# Altium schematic sheet MCU.SchDoc: ESP32-S3
size 292 x 193 mm; CheckedBy: Jakub Howors; Author: Łukasz Gójski; CompanyName: Politechnika Warszawska; Organization: EITI; Address1: Nowowiejska 15/19; Address2: 00-665 Warszawa; SheetNumber: 8; SheetTotal: 13; HTTPLink: www.pw.edu.pl
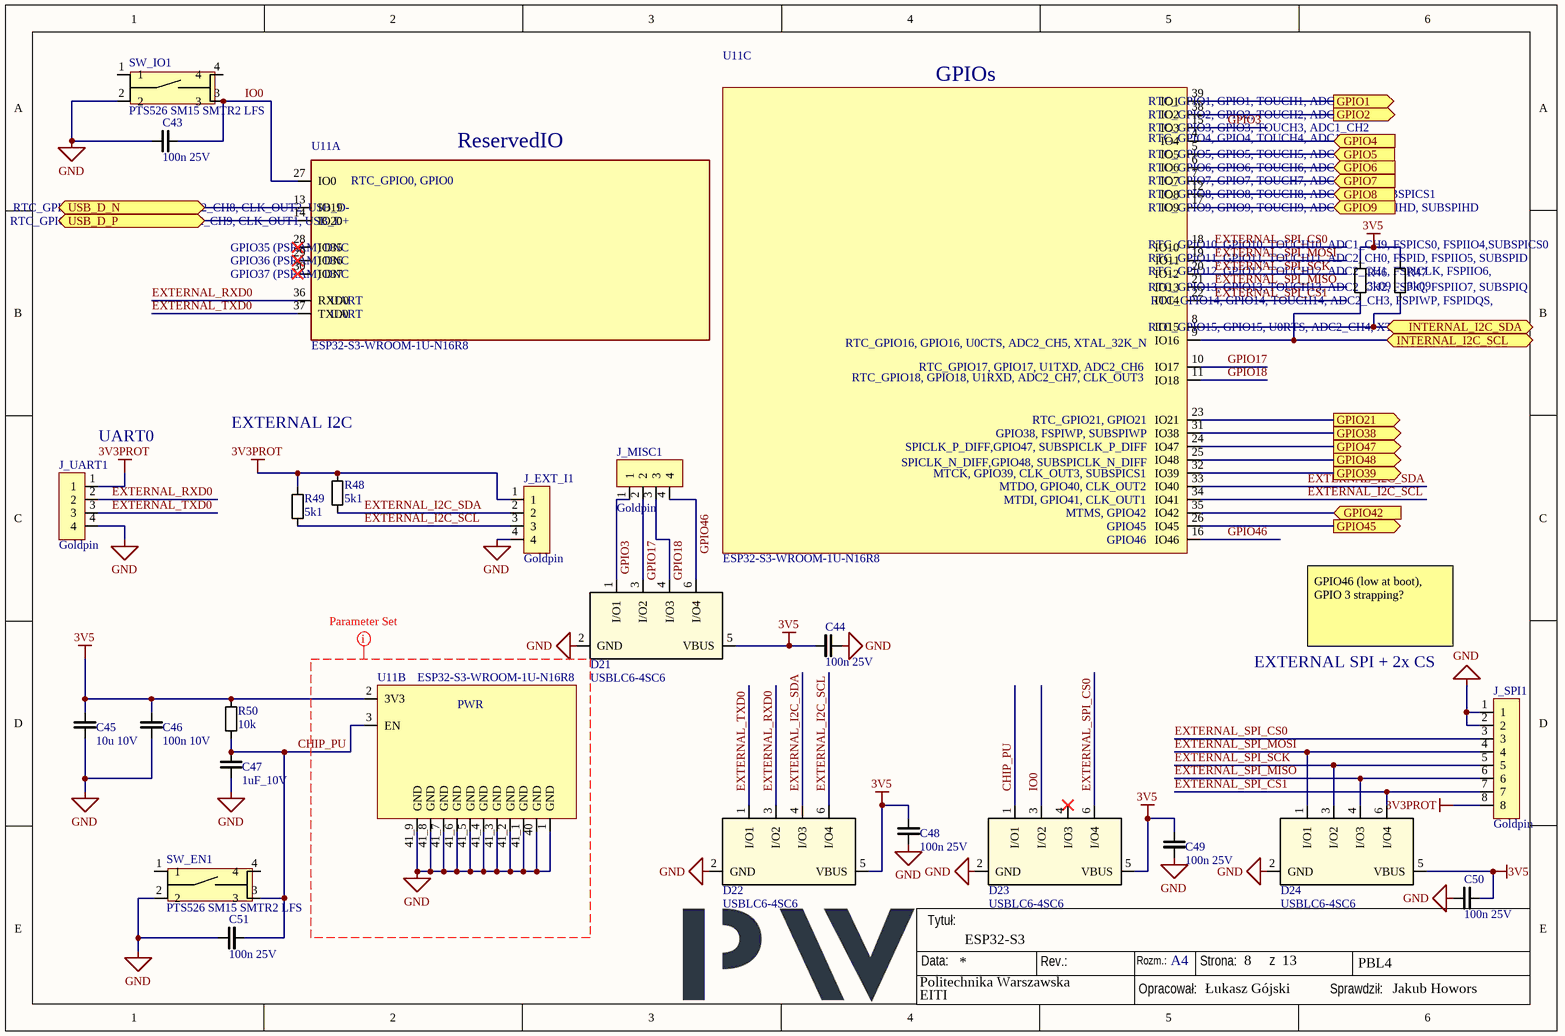
[diagram p0: MCU.SchDoc]

## Parts
C43  100n 25V  [C_0603]
C44  100n 25V  [C_0603]
C45  10u 10V  [C_0805]
C46  100n 10V  [C_0603]
C47  1uF_10V  [C_0603]
C48  100n 25V  [C_0603]
C49  100n 25V  [C_0603]
C50  100n 25V  [C_0603]
C51  100n 25V  [C_0603]
D21  USBLC6-4SC6  [SOT23-6L_STM]
D22  USBLC6-4SC6  [SOT23-6L_STM]
D23  USBLC6-4SC6  [SOT23-6L_STM]
D24  USBLC6-4SC6  [SOT23-6L_STM]
J_EXT_I1  Goldpin  [goldpin4]
J_MISC1  Goldpin  [goldpin4]
J_SPI1  Goldpin  [goldpin8]
J_UART1  Goldpin  [goldpin4]
R46  3k09  [R_0603]
R47  3k09  [R_0603]
R48  5k1  [R_0603]
R49  5k1  [R_0603]
R50  10k  [R_0603]
SW_EN1  PTS526 SM15 SMTR2 LFS  [PTS526SK15SMTR2LFS]
SW_IO1  PTS526 SM15 SMTR2 LFS  [PTS526SK15SMTR2LFS]
U11  ESP32-S3-WROOM-1U-N16R8  [XCVR_ESP32-S3-WROOM-1U-N16R8]  (parts A,B,C of 3)

## Ports
GPIO1 (out, see MainAssembly[2D]), GPIO2 (out, see MainAssembly[2D]), GPIO4 (in, see MainAssembly[1D]), GPIO5 (in, see MainAssembly[1D]), GPIO6 (in, see MainAssembly[1E]), GPIO7 (in, see MainAssembly[1E]), GPIO8 (in, see MainAssembly[1D]), GPIO9 (in, see MainAssembly[1D]), GPIO21 (out, see MainAssembly[2D]), GPIO38 (out, see MainAssembly[2E]), GPIO39 (out, see MainAssembly[2E]), GPIO42 (in, see MainAssembly[1D]), GPIO45 (out, see MainAssembly[2D]), GPIO47 (out, see MainAssembly[2D]), GPIO48 (out, see MainAssembly[2D]), INTERNAL_I2C_SCL (bidir, see MainAssembly[2C], PowerAssembly[4D]), INTERNAL_I2C_SDA (bidir, see MainAssembly[2C], PowerAssembly[4C]), USB_D_N (bidir, see MainAssembly[1C], PowerAssembly[1A], USBPD[1D]), USB_D_P (bidir, see MainAssembly[1C], PowerAssembly[1A], USBPD[1D])

## Nets
3V3PROT: J_EXT_I1.1 J_SPI1.8 J_UART1.1 R48.2 R49.2
3V5: C44.2 C45.2 C46.2 C48.2 C49.2 C50.2 D21.5(VBUS) D22.5(VBUS) D23.5(VBUS) D24.5(VBUS) R46.2 R47.2 R50.2 U11.2(3V3)
GND: C43.1 C44.1 C45.1 C46.1 C47.1 C48.1 C49.1 C50.1 C51.1 D21.2(GND) D22.2(GND) D23.2(GND) D24.2(GND) J_EXT_I1.4 J_SPI1.1 J_SPI1.2 J_UART1.4 SW_EN1.2 SW_IO1.2 U11.1(GND) U11.40(GND) U11.41_1(GND) U11.41_2(GND) U11.41_3(GND) U11.41_4(GND) U11.41_5(GND) U11.41_6(GND) U11.41_7(GND) U11.41_8(GND) U11.41_9(GND)
CHIP_PU: C47.2 C51.2 D23.1(I/O1) R50.1 SW_EN1.3 U11.3(EN)
EXTERNAL_I2C_SCL: D22.6(I/O4) J_EXT_I1.3 R49.1 U11.34(IO41)
EXTERNAL_I2C_SDA: D22.4(I/O3) J_EXT_I1.2 R48.1 U11.33(IO40)
EXTERNAL_RXD0: D22.3(I/O2) J_UART1.2 U11.36(RXD0)
EXTERNAL_SPI_CS0: D23.6(I/O4) J_SPI1.3 U11.18(IO10)
EXTERNAL_SPI_CS1: D24.6(I/O4) J_SPI1.7 U11.22(IO14)
EXTERNAL_SPI_MISO: D24.4(I/O3) J_SPI1.6 U11.21(IO13)
EXTERNAL_SPI_MOSI: D24.1(I/O1) J_SPI1.4 U11.19(IO11)
EXTERNAL_SPI_SCK: D24.3(I/O2) J_SPI1.5 U11.20(IO12)
EXTERNAL_TXD0: D22.1(I/O1) J_UART1.3 U11.37(TXD0)
GPIO1: U11.39(IO1) ; port GPIO1
GPIO2: U11.38(IO2) ; port GPIO2
GPIO3: D21.1(I/O1) J_MISC1.1 U11.15(IO3)
GPIO4: U11.4(IO4) ; port GPIO4
GPIO5: U11.5(IO5) ; port GPIO5
GPIO6: U11.6(IO6) ; port GPIO6
GPIO7: U11.7(IO7) ; port GPIO7
GPIO8: U11.12(IO8) ; port GPIO8
GPIO9: U11.17(IO9) ; port GPIO9
GPIO17: D21.3(I/O2) J_MISC1.2 U11.10(IO17)
GPIO18: D21.4(I/O3) J_MISC1.3 U11.11(IO18)
GPIO21: U11.23(IO21) ; port GPIO21
GPIO38: U11.31(IO38) ; port GPIO38
GPIO39: U11.32(IO39) ; port GPIO39
GPIO42: U11.35(IO42) ; port GPIO42
GPIO45: U11.26(IO45) ; port GPIO45
GPIO46: D21.6(I/O4) J_MISC1.4 U11.16(IO46)
GPIO47: U11.24(IO47) ; port GPIO47
GPIO48: U11.25(IO48) ; port GPIO48
INTERNAL_I2C_SCL: R46.1 U11.9(IO16) ; port INTERNAL_I2C_SCL
INTERNAL_I2C_SDA: R47.1 U11.8(IO15) ; port INTERNAL_I2C_SDA
IO0: C43.2 D23.3(I/O2) SW_IO1.3 U11.27(IO0)
USB_D_N: U11.13(IO19) ; port USB_D_N
USB_D_P: U11.14(IO20) ; port USB_D_P

Not connected (* = marked no-connect by the designer): D23 4(I/O3)*; SW_EN1 1 4; SW_IO1 1 4; U11 28(IO35)* 29(IO36)* 30(IO37)*

## Layout directives
CompClassName: NoRelief: GND

## Notes on the sheet
- (near J_UART1) UART0
- EXTERNAL I2C
- GPIO46 (low at boot), GPIO 3 strapping?
- EXTERNAL SPI + 2x CS
- Data:
- Tytuł:
- Rev.:
- Rozm.:
- A4
- Strona:
- z
- PBL4
- Opracował:
- Sprawdził:
- (in symbol ESP32-S3-WROOM-1U-N16R8, part A) ReservedIO; RTC_GPIO0, GPIO0; RTC_GPIO19, GPIO19, U1RTS, ADC2_CH8, CLK_OUT2, USB_D-; RTC_GPIO20, GPIO20, U1CTS, ADC2_CH9, CLK_OUT1, USB_D+; GPIO35 (PSRAM) DNC; GPIO36 (PSRAM) DNC; GPIO37 (PSRAM) DNC; UART
- (in symbol ESP32-S3-WROOM-1U-N16R8, part B) PWR
- (in symbol ESP32-S3-WROOM-1U-N16R8, part C) GPIOs; RTC_GPIO1, GPIO1, TOUCH1, ADC1_CH0; RTC_GPIO2, GPIO2, TOUCH2, ADC1_CH1; RTC_GPIO3, GPIO3, TOUCH3, ADC1_CH2; RTC_GPIO4, GPIO4, TOUCH4, ADC1_CH3; RTC_GPIO5, GPIO5, TOUCH5, ADC1_CH4; RTC_GPIO6, GPIO6, TOUCH6, ADC1_CH5; RTC_GPIO7, GPIO7, TOUCH7, ADC1_CH6; RTC_GPIO8, GPIO8, TOUCH8, ADC1_CH7, SUBSPICS1; RTC_GPIO9, GPIO9, TOUCH9, ADC1_CH8, FSPIHD, SUBSPIHD; RTC_GPIO10, GPIO10, TOUCH10, ADC1_CH9, FSPICS0, FSPIIO4,SUBSPICS0; RTC_GPIO11, GPIO11, TOUCH11, ADC2_CH0, FSPID, FSPIIO5, SUBSPID; RTC_GPIO12, GPIO12, TOUCH12, ADC2_CH1, FSPICLK, FSPIIO6,; RTC_GPIO13, GPIO13, TOUCH13, ADC2_CH2, FSPIQ, FSPIIO7, SUBSPIQ; RTC_GPIO14, GPIO14, TOUCH14, ADC2_CH3, FSPIWP, FSPIDQS,; RTC_GPIO15, GPIO15, U0RTS, ADC2_CH4, XTAL_32K_P; RTC_GPIO16, GPIO16, U0CTS, ADC2_CH5, XTAL_32K_N; RTC_GPIO17, GPIO17, U1TXD, ADC2_CH6; RTC_GPIO18, GPIO18, U1RXD, ADC2_CH7, CLK_OUT3; RTC_GPIO21, GPIO21; GPIO38, FSPIWP, SUBSPIWP; SPICLK_P_DIFF,GPIO47, SUBSPICLK_P_DIFF; SPICLK_N_DIFF,GPIO48, SUBSPICLK_N_DIFF; MTCK, GPIO39, CLK_OUT3, SUBSPICS1; MTDO, GPIO40, CLK_OUT2; MTDI, GPIO41, CLK_OUT1; MTMS, GPIO42; GPIO45; GPIO46

## Library data of the parts
C43 C44 C48-C51 = C_100nF_25V: Ceramic capacitor; Casing: 0603; Dielectric: X7R; Tolerance: 10%; Value: 100n; Voltage: 25V; Technology: Ceramic
C45 = C_10uF_10V: Ceramic capacitor; Casing: 0805; Dielectric: X5R; Tolerance: 10%; Value: 10u; Voltage: 10V; Technology: Ceramic
C46 = C_100nF_10V: Ceramic capacitor; Casing: 0603; Dielectric: X7R; Tolerance: 10%; Value: 100n; Voltage: 10V; Technology: Ceramic
C47 = C_1uF_10V: Ceramic capacitor; Value: 1u; Voltage: 10V; Casing: 0603; Dielectric: X7R; Tolerance: 10%; Technology: Ceramic
D21-D24 = USBLC6-4SC6: Very low capacitance ESD protection; Manufacturer: STMicroelectronics; Manufacturer_Part_Number: USBLC6-4SC6
J_EXT_I1 J_MISC1 J_UART1 = Goldpin_array_4: Goldpin Male 4
J_SPI1 = Goldpin_array_8: Goldpin Male 8
R46 R47 = R_3k09: Resistor; Tolerance: 1%; Power: 100mW; Casing: 0603; Value: 3k09
R48 R49 = R_5k1: Resistor; Tolerance: 1%; Power: 100mW; Casing: 0603; Value: 5k1
R50 = R_10k: Resistor; Tolerance: 1%; Power: 100mW; Casing: 0603; Value: 10k
SW_EN1 SW_IO1 = Button: NO button; Manufacturer: C&K Components; Manufacturer_Part_Number: PTS526 SM15 SMTR2 LFS
U11 = ESP32-S3-WROOM-1U-N16R8: Bluetooth, WiFi 802.11b/g/n, Bluetooth v5.0 Transceiver Module 2.4GHz Antenna Not Included, U.FL Surface Mount; MF: Espressif Systems; Package: None; Price: None; Value: *; SnapEDA_Link: https://www.snapeda.com/parts/ESP32-S3-WROOM-1U-N16R8/Espressif+Systems/view-part/?ref=snap; MP: ESP32-S3-WROOM-1U-N16R8; Availability: Unavailable; Check_prices: https://www.snapeda.com/parts/ESP32-S3-WROOM-1U-N16R8/Espressif+Systems/view-part/?ref=eda